# Altium schematic sheet Wi fi connector.SchDoc
size A4
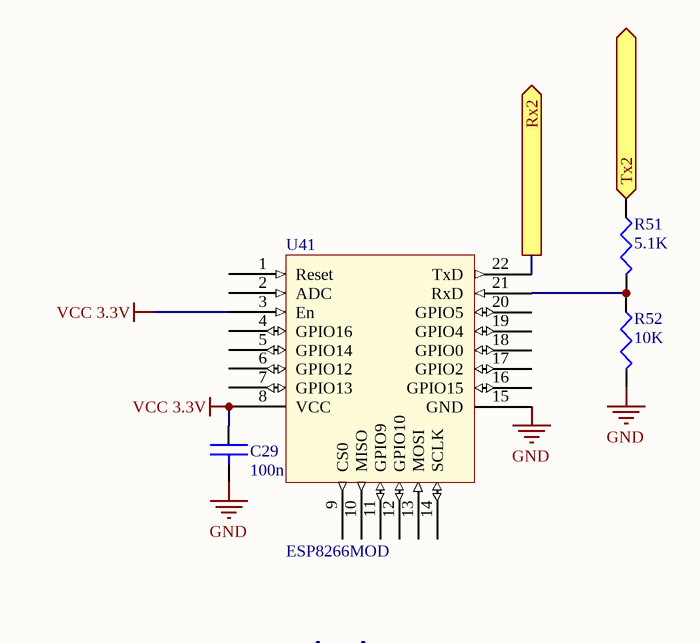
[diagram p0: Wi fi connector.SchDoc]

## Parts
C29  value 100n  [0805]  (hidden comment: CAP)
R51  value 5.1K  [0805]  (hidden comment: RES)
R52  value 10K  [0805]  (hidden comment: RES)
U41  ESP8266MOD  [ESP8266MOD Footprint]

## Ports
Rx2 (out), Tx2 (in)

## Nets
GND: C29.2 R52.2 U41.15(GND)
VCC 3.3V: C29.1 U41.3(En) U41.8(VCC)
Rx2: U41.22(TxD) ; port Rx2
Tx2: R51.1 ; port Tx2
NetR51_2: R51.2 R52.1 U41.21(RxD)

Not connected (* = marked no-connect by the designer): U41 1(Reset) 2(ADC) 4(GPIO16) 5(GPIO14) 6(GPIO12) 7(GPIO13) 9(CS0) 10(MISO) 11(GPIO9) 12(GPIO10) 13(MOSI) 14(SCLK) 16(GPIO15) 17(GPIO2) 18(GPIO0) 19(GPIO4) 20(GPIO5)

## Notes on the sheet
- WIFI

## Library data of the parts
C29 = CAP: capacité non polarisée
R51 R52 = RES: resistance
U41 = ESP8266MOD: Wi fi ESP